# Altium schematic sheet 串口密码锁接收.SchDoc
size A3
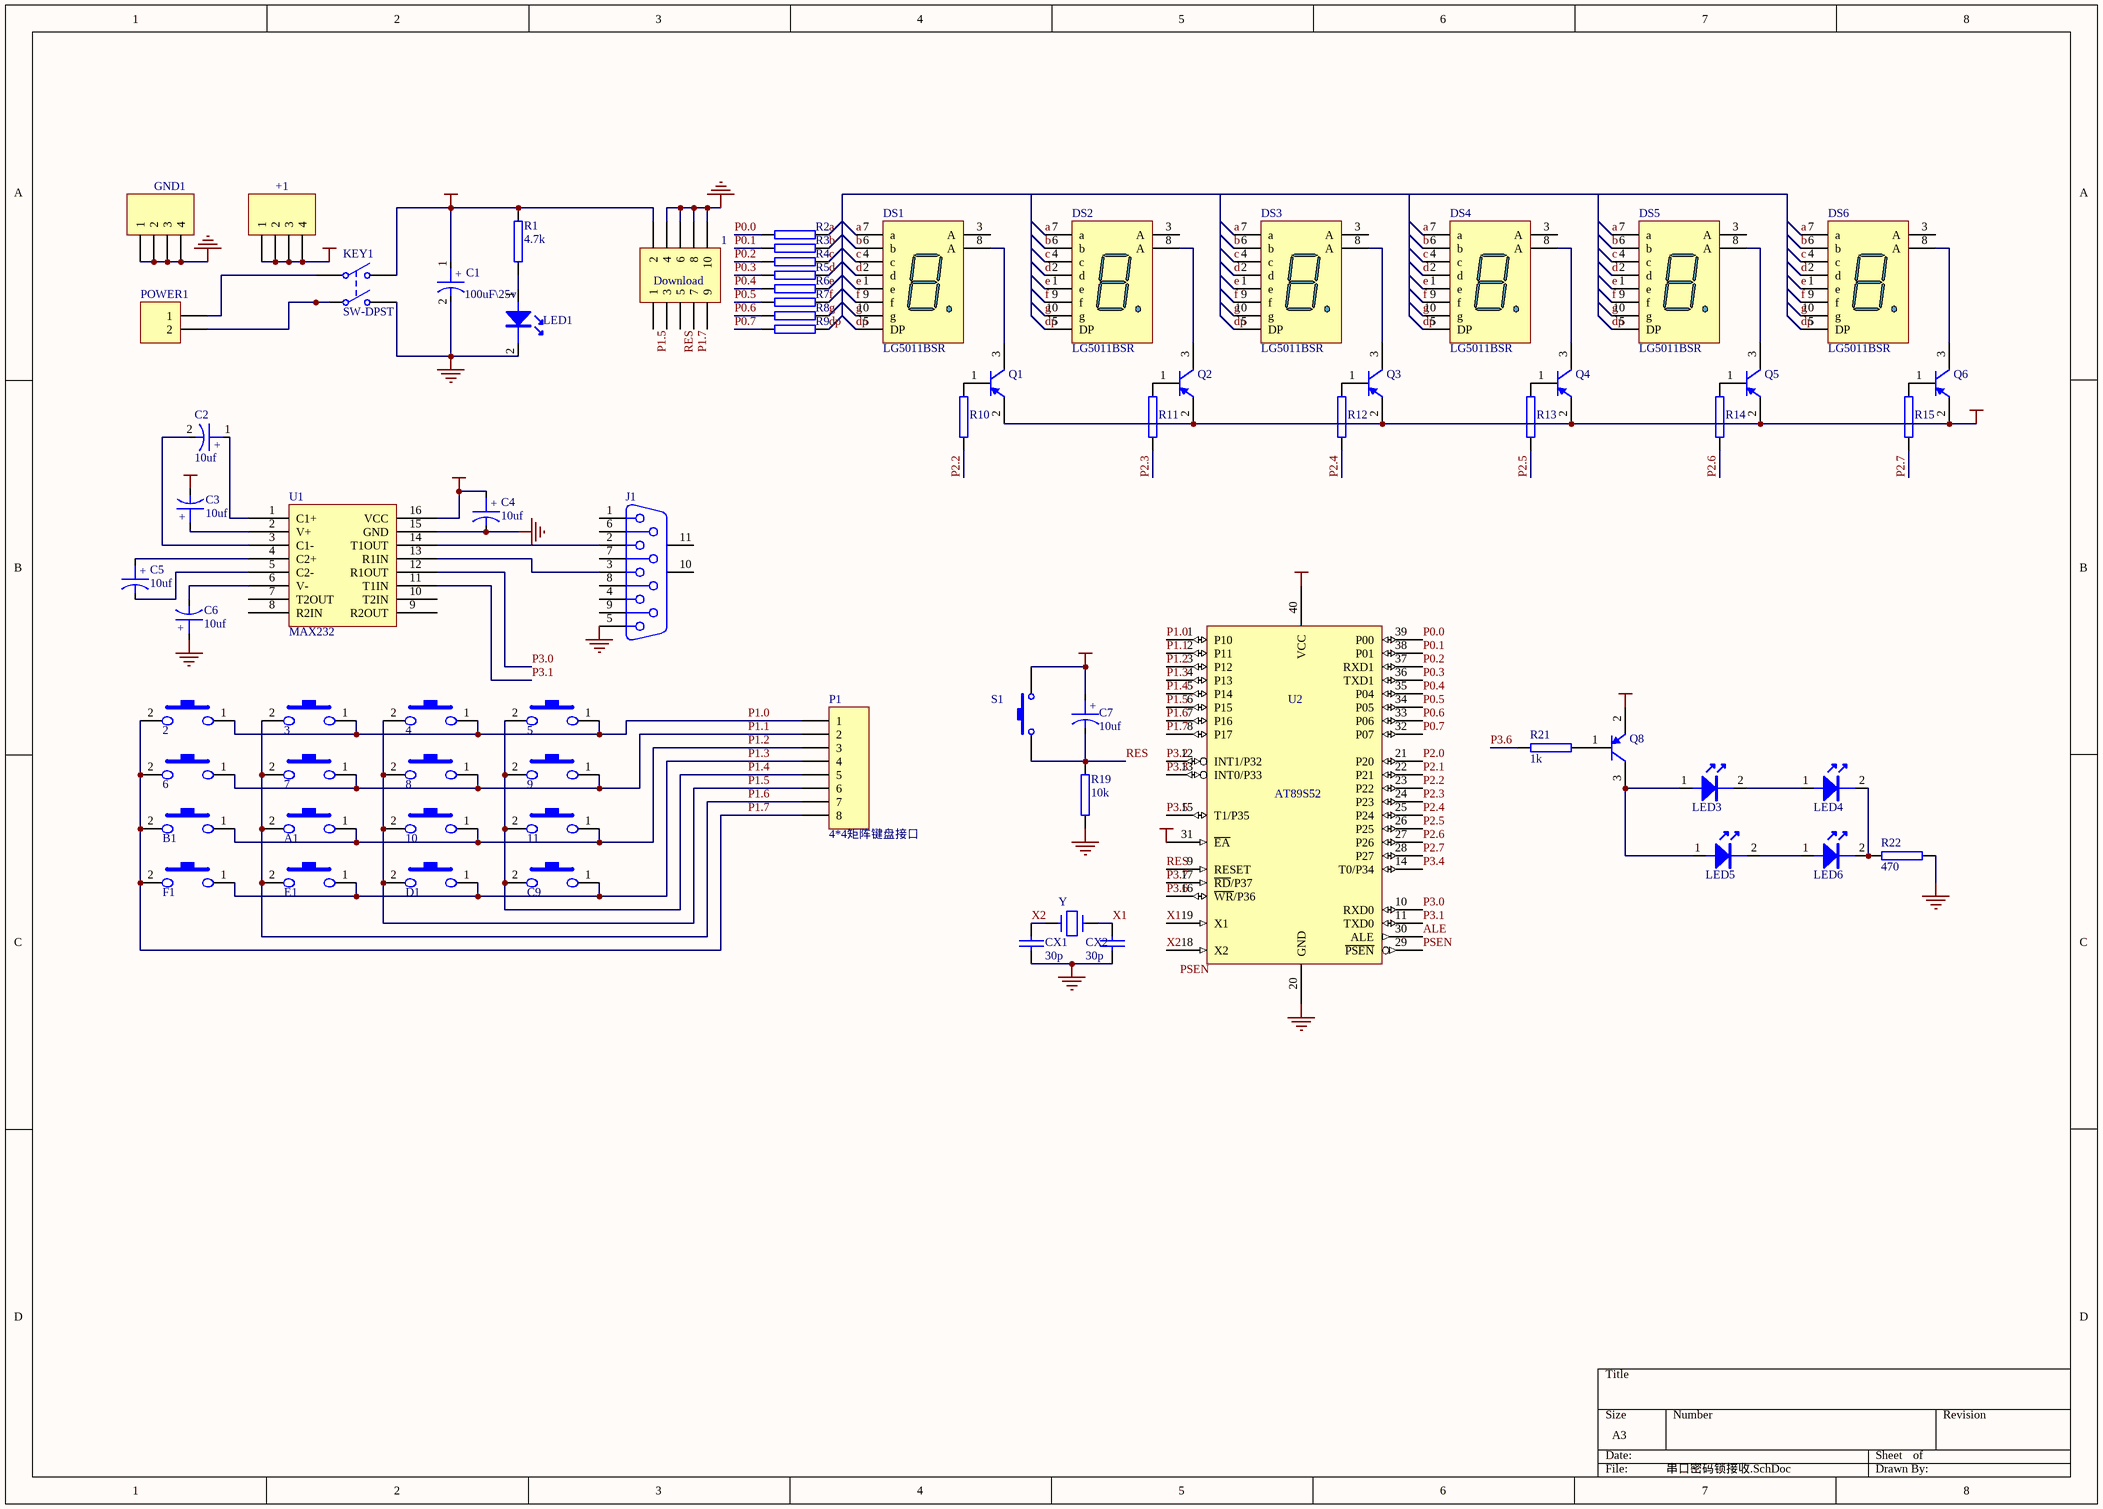
[diagram p0: 串口密码锁接收.SchDoc]

## Parts
1  Download  [HDR-2x5]
2  key1  [an-6*6]  (value not drawn)
3  key1  [an-6*6]  (value not drawn)
4  key1  [an-6*6]  (value not drawn)
5  key1  [an-6*6]  (value not drawn)
6  key2  [an-6*6]  (value not drawn)
7  key2  [an-6*6]  (value not drawn)
8  key2  [an-6*6]  (value not drawn)
9  key2  [an-6*6]  (value not drawn)
10  key3  [an-6*6]  (value not drawn)
11  key3  [an-6*6]  (value not drawn)
+1  (no value)  [HDR1X4]
A1  key3  [an-6*6]  (value not drawn)
B1  key3  [an-6*6]  (value not drawn)
C1  100uF\25v  [C-DJ-6]
C2  10uf  [C-DJ-4]
C3  10uf  [C-DJ-4]
C4  10uf  [C-DJ-4]
C5  10uf  [C-DJ-4]
C6  10uf  [C-DJ-4]
C7  10uf  [C-DJ-4]
C9  key4  [an-6*6]  (value not drawn)
CX1  30p  [HDR1X2]
CX2  30p  [HDR1X2]
D1  key4  [an-6*6]  (value not drawn)
DS1  LG5011BSR  [LED-BSR]
DS2  LG5011BSR  [LED-BSR]
DS3  LG5011BSR  [LED-BSR]
DS4  LG5011BSR  [LED-BSR]
DS5  LG5011BSR  [LED-BSR]
DS6  LG5011BSR  [LED-BSR]
E1  key4  [an-6*6]  (value not drawn)
F1  key4  [an-6*6]  (value not drawn)
GND1  (no value)  [HDR1X4]
J1  D Connector 9  [DSUB1.385-2H9]  (value not drawn)
KEY1  SW-DPST  [DPDT-6]
LED1  LED  [LED]  (value not drawn)
LED3  LED  [LED]  (value not drawn)
LED4  LED  [LED]  (value not drawn)
LED5  LED  [LED]  (value not drawn)
LED6  LED  [LED]  (value not drawn)
P1  4*4矩阵键盘接口  [HDR1X8]
POWER1  (no value)  [JK128]
Q1  2N3906  [SO-G3]  (value not drawn)
Q2  2N3906  [SO-G3]  (value not drawn)
Q3  2N3906  [SO-G3]  (value not drawn)
Q4  2N3906  [SO-G3]  (value not drawn)
Q5  2N3906  [SO-G3]  (value not drawn)
Q6  2N3906  [SO-G3]  (value not drawn)
Q8  2N3906  [SO-G3]  (value not drawn)
R1  4.7k  [R2012-0805]
R2  470  [R2012-0805]  (value not drawn)
R3  470  [R2012-0805]  (value not drawn)
R4  470  [R2012-0805]  (value not drawn)
R5  470  [R2012-0805]  (value not drawn)
R6  470  [R2012-0805]  (value not drawn)
R7  470  [R2012-0805]  (value not drawn)
R8  470  [R2012-0805]  (value not drawn)
R9  470  [R2012-0805]  (value not drawn)
R10  470  [R2012-0805]  (value not drawn)
R11  470  [R2012-0805]  (value not drawn)
R12  470  [R2012-0805]  (value not drawn)
R13  470  [R2012-0805]  (value not drawn)
R14  470  [R2012-0805]  (value not drawn)
R15  470  [R2012-0805]  (value not drawn)
R19  10k  [R2012-0805]
R21  1k  [R2012-0805]
R22  470  [R2012-0805]
S1  (no value)  [an-6*6]
U1  MAX232  [DIP16]
U2  AT89S52  [AT89S52Pid]
Y1  Y  [11.0592M]

## Nets
GND: 1.4 1.6 1.8 1.10 C1.2 C4.2 C6.1 CX1.2 CX2.2 GND1.1 GND1.2 GND1.3 GND1.4 J1.5 KEY1.4(NO2) LED1.2(K) R19.2 R22.2 U1.15(GND) U2.20(GND)
VCC: 1.2 +1.1 +1.2 +1.3 +1.4 C1.1 C3.2 C4.1 C7.1 KEY1.2(NO1) Q1.2(E) Q2.2(E) Q3.2(E) Q4.2(E) Q5.2(E) Q6.2(E) Q8.2(E) R1.1 S1.2 U1.16(VCC) U2.31(~{EA}) U2.40(VCC)
a: DS1.7(a) DS2.7(a) DS3.7(a) DS4.7(a) DS5.7(a) DS6.7(a) R2.2
ALE: U2.30(ALE)
b: DS1.6(b) DS2.6(b) DS3.6(b) DS4.6(b) DS5.6(b) DS6.6(b) R3.2
c: DS1.4(c) DS2.4(c) DS3.4(c) DS4.4(c) DS5.4(c) DS6.4(c) R4.2
d: DS1.2(d) DS2.2(d) DS3.2(d) DS4.2(d) DS5.2(d) DS6.2(d) R5.2
dp: DS1.5(DP) DS2.5(DP) DS3.5(DP) DS4.5(DP) DS5.5(DP) DS6.5(DP) R9.2
e: DS1.1(e) DS2.1(e) DS3.1(e) DS4.1(e) DS5.1(e) DS6.1(e) R6.2
f: DS1.9(f) DS2.9(f) DS3.9(f) DS4.9(f) DS5.9(f) DS6.9(f) R7.2
g: DS1.10(g) DS2.10(g) DS3.10(g) DS4.10(g) DS5.10(g) DS6.10(g) R8.2
P0.0: R2.1 U2.39(P00)
P0.1: R3.1 U2.38(P01)
P0.2: R4.1 U2.37(RXD1)
P0.3: R5.1 U2.36(TXD1)
P0.4: R6.1 U2.35(P04)
P0.5: R7.1 U2.34(P05)
P0.6: R8.1 U2.33(P06)
P0.7: R9.1 U2.32(P07)
P1.0: 2.1 3.1 4.1 5.1 P1.1 U2.1(P10)
P1.1: 6.1 7.1 8.1 9.1 P1.2 U2.2(P11)
P1.2: 10.1 11.1 A1.1 B1.1 P1.3 U2.3(P12)
P1.3: C9.1 D1.1 E1.1 F1.1 P1.4 U2.4(P13)
P1.4: 5.2 9.2 11.2 C9.2 P1.5 U2.5(P14)
P1.5: 1.1 4.2 8.2 10.2 D1.2 P1.6 U2.6(P15)
P1.6: 3.2 7.2 A1.2 E1.2 P1.7 U2.7(P16)
P1.7: 1.7 2.2 6.2 B1.2 F1.2 P1.8 U2.8(P17)
P2.0: U2.21(P20)
P2.1: U2.22(P21)
P2.2: R10.1 U2.23(P22)
P2.3: R11.1 U2.24(P23)
P2.4: R12.1 U2.25(P24)
P2.5: R13.1 U2.26(P25)
P2.6: R14.1 U2.27(P26)
P2.7: R15.1 U2.28(P27)
P3.0: U1.12(R1OUT) U2.10(RXD0)
P3.1: U1.11(T1IN) U2.11(TXD0)
P3.2: U2.12(INT1/P32)
P3.3: U2.13(INT0/P33)
P3.4: U2.14(T0/P34)
P3.5: U2.15(T1/P35)
P3.6: R21.1 U2.16(~{WR}/P36)
P3.7: U2.17(~{RD}/P37)
PSEN: U2.29(~{PSEN})
RES: 1.5 C7.2 R19.1 S1.1 U2.9(RESET)
X1: CX2.1 U2.19(X1) Y1.1
X2: CX1.1 U2.18(X2) Y1.2
NetC2_1: C2.1 U1.1(C1+)
NetC2_2: C2.2 U1.3(C1-)
NetC3_1: C3.1 U1.2(V+)
NetC5_1: C5.1 U1.4(C2+)
NetC5_2: C5.2 U1.5(C2-)
NetC6_2: C6.2 U1.6(V-)
NetDS1_8: DS1.8(A) Q1.3(C)
NetDS2_8: DS2.8(A) Q2.3(C)
NetDS3_8: DS3.8(A) Q3.3(C)
NetDS4_8: DS4.8(A) Q4.3(C)
NetDS5_8: DS5.8(A) Q5.3(C)
NetDS6_8: DS6.8(A) Q6.3(C)
NetJ1_2: J1.2 U1.14(T1OUT)
NetJ1_3: J1.3 U1.13(R1IN)
NetKEY1_1: KEY1.1(COMMON1) POWER1.1
NetKEY1_3: KEY1.3(COMMON2) POWER1.2
NetLED1_1: LED1.1(A) R1.2
NetLED3_1: LED3.1(A) LED5.1(A) Q8.3(C)
NetLED3_2: LED3.2(K) LED4.1(A)
NetLED4_2: LED4.2(K) LED6.2(K) R22.1
NetLED5_2: LED5.2(K) LED6.1(A)
NetQ1_1: Q1.1(B) R10.2
NetQ2_1: Q2.1(B) R11.2
NetQ3_1: Q3.1(B) R12.2
NetQ4_1: Q4.1(B) R13.2
NetQ5_1: Q5.1(B) R14.2
NetQ6_1: Q6.1(B) R15.2
NetQ8_1: Q8.1(B) R21.2

Not connected (* = marked no-connect by the designer): 1 3 9; DS1 3(A); DS2 3(A); DS3 3(A); DS4 3(A); DS5 3(A); DS6 3(A); J1 1 4 6 7 8 9 10(MH1) 11(MH2); U1 7(T2OUT) 8(R2IN) 9(R2OUT) 10(T2IN)

## Notes on the sheet
- Labels drawn without touching a wire or pin: PSEN
- (in symbol CAPACITOR POL) +

## Library data of the parts
1 = Header 5X2: Header, 5-Pin, Dual row; Revision: 17-Jul-2002: Re-released for DXP Platform.; Publisher: Altium Limited
2-11 A1 B1 C9 D1 E1 F1 = key
+1 GND1 = Header 4: Header, 4-Pin; Revision: 17-Jul-2002: Re-released for DXP Platform.; Publisher: Altium Limited
C1-C7 = CAPACITOR POL: Capacitor
CX1 CX2 = CAP: Capacitor
DS1-DS6 = Dpy Blue-CA: 14.2 mm General Purpose Blue 7-Segment Display: CA, RH DP, Gray Surface; MinimumIntensity: 2020 ucd; Note: IF = 10 mA; Published: 8-Jun-2000; LatestRevisionDate: 17-Dec-2003; LatestRevisionNote: Schematic revised, PCB Footprint replaced.; DatasheetDocument: 24-Sep-2002; PackageDocument: 24-Sep-2002; PackageReference: H; Publisher: Altium Limited; Colour: Blue
J1 = D Connector 9: Receptacle Assembly, 9 Position, Right Angle; Package Information: Latest Revision: O; Positions: 9; Published: 15-Jun-2001; Revision: 17-Jul-2002: Re-released for DXP Platform.; Datasheet: (1-Sep-1999); Package Reference: 788750; Publisher: Altium Limited; Orientation: Right Angle; Gender: Receptacle
KEY1 = SW-DPST: Double-Pole, Single-Throw Switch; Published: 24-Mar-1999; Revision: July-2002: Re-released for DXP Platform.; Publisher: Altium Limited
P1 = Header 8: Header, 8-Pin; LatestRevisionDate: 17-Jul-2002; LatestRevisionNote: Re-released for DXP Platform.; Publisher: Altium Limited
POWER1 = Header 2: Header, 2-Pin; LatestRevisionDate: 17-Jul-2002; LatestRevisionNote: Re-released for DXP Platform.; Publisher: Altium Limited
Q1-Q6 Q8 = 2N3906: PNP General Purpose Amplifier; Revision 1: 11-Jul-2000: SIM Model Added.; Revision 2: 17-Jul-2002: Re-released for DXP Platform.; Revision 3: 15-Jan-2003: PCB Footprint 'BCY-W3/D4.7' replaced; Code - JEDEC: TO-92A; Published: 8-Jun-2000; Datasheet: Latest Revision: 1997; Package Reference: TO-92A; Publisher: Altium Limited
R1-R15 R19 R21 R22 = RES2
S1 = SW-PB: Switch; Published: 24-Mar-1999; LatestRevisionDate: 17-Jul-2002; LatestRevisionNote: Re-released for DXP Platform.; Publisher: Altium Limited
U2 = 8051
Y1 = CRYSTAL